# Altium schematic sheet Power_Supply.SchDoc: Apalis Evaluation Board 1.1
size A3; Organization: Toradex AG; Address1: Altsagenstrasse 5; Address2: Horw; Address3: 6048; Address4: Switzerland; DocumentNumber: 3; Revision: V1.1; SheetNumber: 3; SheetTotal: 32; PageSetup: Record=PageOptions|CenterHorizontal=True|CenterVertical=True|PrintScale=0.73|XCorrection=1.00|YCorrection=1.00|PrintKind=0|BorderSize=5000000|LeftOffset=0|BottomOffset=0|Orientation=2|PaperLength=1000|PaperWidth=1000|Scale=100|PaperSource=7|PrintQuality=-4|MediaType=1|DitherType=10|PaperKind=A4|PrintScaleMode=1
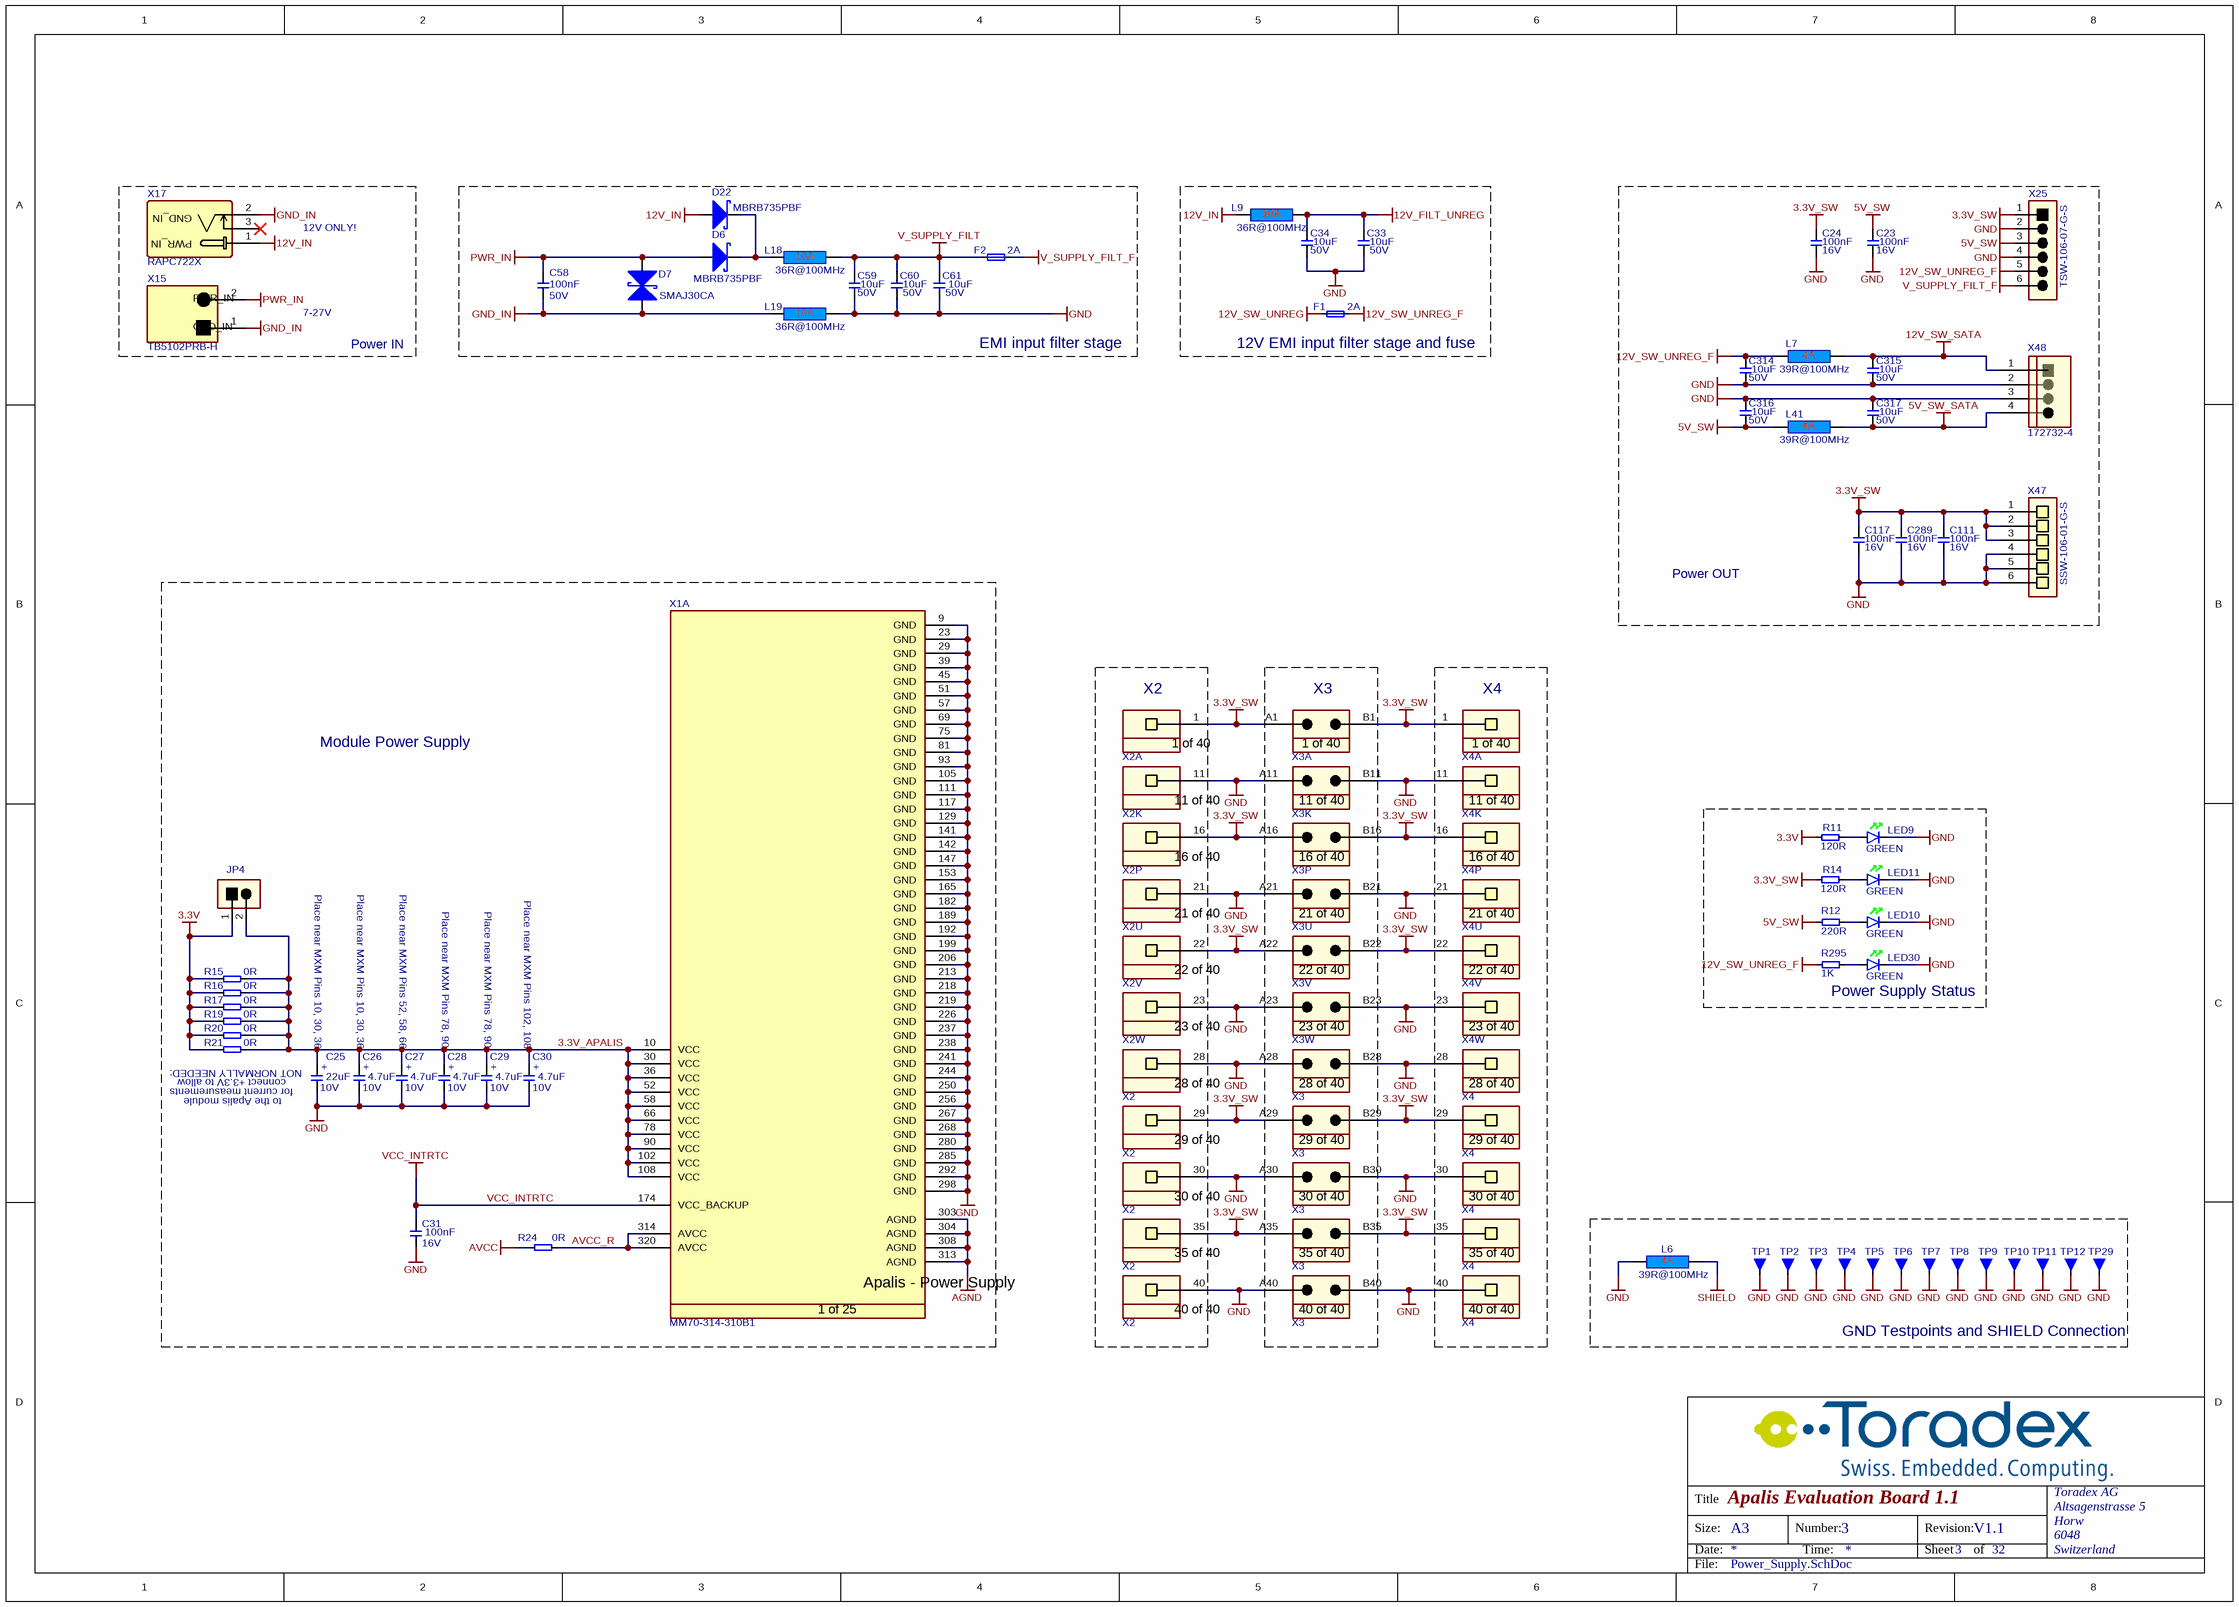
[diagram p0: Power_Supply.SchDoc]

## Parts
C23  Rating: 16V  [T_CAPC0603X33N]  (hidden comment: 100nF)
C24  Rating: 16V  [T_CAPC0603X33N]  (hidden comment: 100nF)
C25  Rating: 10V  [CAPMP3528X210N]  (hidden comment: 22uF)
C26  Rating: 10V  [T_CAPMP3216X180N]  (hidden comment: 4.7uF)
C27  Rating: 10V  [T_CAPMP3216X180N]  (hidden comment: 4.7uF)
C28  Rating: 10V  [T_CAPMP3216X180N]  (hidden comment: 4.7uF)
C29  Rating: 10V  [T_CAPMP3216X180N]  (hidden comment: 4.7uF)
C30  Rating: 10V  [T_CAPMP3216X180N]  (hidden comment: 4.7uF)
C31  Rating: 16V  [T_CAPC0603X33N]  (hidden comment: 100nF)
C33  Rating: 50V  [CAPC3225X160N]  (hidden comment: 10uF)
C34  Rating: 50V  [CAPC3225X160N]  (hidden comment: 10uF)
C58  Rating: 50V  [T_CAPC0603X33N]  (hidden comment: 100nF)
C59  Rating: 50V  [CAPC3225X160N]  (hidden comment: 10uF)
C60  Rating: 50V  [CAPC3225X160N]  (hidden comment: 10uF)
C61  Rating: 50V  [CAPC3225X160N]  (hidden comment: 10uF)
C111  Rating: 16V  [T_CAPC0603X33N]  (hidden comment: 100nF)
C117  Rating: 16V  [T_CAPC0603X33N]  (hidden comment: 100nF)
C289  Rating: 16V  [T_CAPC0603X33N]  (hidden comment: 100nF)
C314  Rating: 50V  [CAPC3225X160N]  (hidden comment: 10uF)
C315  Rating: 50V  [CAPC3225X160N]  (hidden comment: 10uF)
C316  Rating: 50V  [CAPC3225X160N]  (hidden comment: 10uF)
C317  Rating: 50V  [CAPC3225X160N]  (hidden comment: 10uF)
D6  MBRB735PBF  [T_VISHAY_MBRB735PBF]
D7  Manufacturer Part No.: SMAJ30CA  [T_LITTLEFUSE_SMAJ30CA]  (hidden comment: D-Littelfuse-SMAJ30CA-Schottky)
D22  MBRB735PBF  [T_VISHAY_MBRB735PBF]
F1  2A  [T_Littelfuse_0458]
F2  2A  [T_Littelfuse_0458]
JP4  TSW-101-07-G-D  [T_Samtec_TSW-101-07-G-D]  (value not drawn)
L6  39R@100MHz  [INDC2013X130N]
L7  39R@100MHz  [INDC2013X130N]
L9  36R@100MHz  [T_Laird_35F0121-0SR-10]
L18  36R@100MHz  [T_Laird_35F0121-0SR-10]
L19  36R@100MHz  [T_Laird_35F0121-0SR-10]
L41  39R@100MHz  [INDC2013X130N]
LED9  Color: GREEN  [T_Osram_T670_GREEN]  (hidden comment: LG T670-K1L2-1)
LED10  Color: GREEN  [T_Osram_T670_GREEN]  (hidden comment: LG T670-K1L2-1)
LED11  Color: GREEN  [T_Osram_T670_GREEN]  (hidden comment: LG T670-K1L2-1)
LED30  Color: GREEN  [T_Osram_T670_GREEN]  (hidden comment: LG T670-K1L2-1)
R11  120R  [T_RESC0603X30N]
R12  220R  [T_RESC0603X30N]
R14  120R  [T_RESC0603X30N]
R15  0R  [T_RESC3216X760N]
R16  0R  [T_RESC3216X760N]
R17  0R  [T_RESC3216X760N]
R19  0R  [T_RESC3216X760N]
R20  0R  [T_RESC3216X760N]
R21  0R  [T_RESC3216X760N]
R24  0R  [T_RESC0603X30N]
R295  1K  [T_RESC0603X30N]
TP1  5011  [T_TP-THT - EYE]  (value not drawn)
TP2  5011  [T_TP-THT - EYE]  (value not drawn)
TP3  5011  [T_TP-THT - EYE]  (value not drawn)
TP4  5011  [T_TP-THT - EYE]  (value not drawn)
TP5  5011  [T_TP-THT - EYE]  (value not drawn)
TP6  5011  [T_TP-THT - EYE]  (value not drawn)
TP7  5011  [T_TP-THT - EYE]  (value not drawn)
TP8  5011  [T_TP-THT - EYE]  (value not drawn)
TP9  5011  [T_TP-THT - EYE]  (value not drawn)
TP10  5011  [T_TP-THT - EYE]  (value not drawn)
TP11  5011  [T_TP-THT - EYE]  (value not drawn)
TP12  5011  [T_TP-THT - EYE]  (value not drawn)
TP29  5011  [T_TP-THT - EYE]  (value not drawn)
X1  Manufacturer Part No.: MM70-314-310B1  [T_JAE_MM70-314-310B1]  (hidden comment: CON-JAE-MM70-314-310B1-314-0.5mm)  (part A of 25)
X2  SSW-110-01-G-S  [T_Samtec_SSW-110-01-G-S]  (value not drawn)  (parts A,K,P,U,V,W,28,29,30,35,40 of 40)
X3  TSW-110-07-G-D  [T_Samtec_TSW-110-07-G-D]  (value not drawn)  (parts A,K,P,U,V,W,28,29,30,35,40 of 40)
X4  SSW-110-01-G-S  [T_Samtec_SSW-110-01-G-S]  (value not drawn)  (parts A,K,P,U,V,W,28,29,30,35,40 of 40)
X15  TB5102PRB-H  [T_AUK_TB5102PRB-H]
X17  RAPC722X  [T_DCJ20-0014TB-L]
X25  TSW-106-07-G-S  [T_samtech_TSW-106-07-G-S]
X47  SSW-106-01-G-S  [T_samtech_SSW-106-01-G-S]
X48  172732-4  [T_TE_172732-4]

## Blocks framed on the sheet
Power IN: X15 X17
EMI input filter stage: C58-C61 D6 D7 D22 F2 L18 L19
12V EMI input filter stage and fuse: C33 C34 F1 L9
Power OUT: C23 C24 C111 C117 C289 C314-C317 L7 L41 X25 X47 X48
Module Power Supply: C25-C31 JP4 R15-R17 R19-R21 R24 X1
X2: X2
X3: X3
X4: X4
Power Supply Status: LED9-LED11 LED30 R11 R12 R14 R295
GND Testpoints and SHIELD Connection: L6 TP1-TP12 TP29

## Nets
3.3V: JP4.1 R11.1 R15.1 R16.1 R17.1 R19.1 R20.1 R21.1
3.3V_SW: C24.2 C111.2 C117.2 C289.2 R14.1 X2.1 X2.16 X2.22 X2.29 X2.35 X3.A1 X3.A16 X3.A22 X3.A29 X3.A35 X3.B1 X3.B16 X3.B22 X3.B29 X3.B35 X4.1 X4.16 X4.22 X4.29 X4.35 X25.1 X47.1 X47.2 X47.3
5V_SW: C23.1 C316.1 L41.1 R12.1 X25.3
5V_SW_SATA: C317.1 L41.2 X48.4(5V)
12V_FILT_UNREG: C33.2 C34.2 L9.2
12V_IN: D22.3 L9.1 X17.1(GND_IN)
12V_SW_SATA: C315.2 L7.2 X48.1(12V)
12V_SW_UNREG: F1.1
12V_SW_UNREG_F: C314.2 F1.2 L7.1 R295.1 X25.5
AGND: X1.303(AGND) X1.304(AGND) X1.308(AGND) X1.313(AGND)
AVCC: R24.1
GND: C23.2 C24.1 C25.2 C26.2 C27.2 C28.2 C29.2 C30.2 C31.1 C33.1 C34.1 C59.1 C60.1 C61.1 C111.1 C117.1 C289.1 C314.1 C315.1 C316.2 C317.2 L6.1 L19.2 LED9.K LED10.K LED11.K LED30.K TP1.1 TP2.1 TP3.1 TP4.1 TP5.1 TP6.1 TP7.1 TP8.1 TP9.1 TP10.1 TP11.1 TP12.1 TP29.1 X1.9(GND) X1.23(GND) X1.29(GND) X1.39(GND) X1.45(GND) X1.51(GND) X1.57(GND) X1.69(GND) X1.75(GND) X1.81(GND) X1.93(GND) X1.105(GND) X1.111(GND) X1.117(GND) X1.129(GND) X1.141(GND) X1.142(GND) X1.147(GND) X1.153(GND) X1.165(GND) X1.182(GND) X1.189(GND) X1.192(GND) X1.199(GND) X1.206(GND) X1.213(GND) X1.218(GND) X1.219(GND) X1.226(GND) X1.237(GND) X1.238(GND) X1.241(GND) X1.244(GND) X1.250(GND) X1.256(GND) X1.267(GND) X1.268(GND) X1.280(GND) X1.285(GND) X1.292(GND) X1.298(GND) X2.11 X2.21 X2.23 X2.28 X2.30 X2.40 X3.A11 X3.A21 X3.A23 X3.A28 X3.A30 X3.A40 X3.B11 X3.B21 X3.B23 X3.B28 X3.B30 X3.B40 X4.11 X4.21 X4.23 X4.28 X4.30 X4.40 X25.2 X25.4 X47.4 X47.5 X47.6 X48.2(GND) X48.3(GND)
GND_IN: C58.1 D7.2(Anode) L19.1 X15.1(GND_IN) X17.2(PWR_IN)
PWR_IN: C58.2 D6.3 D7.1(Cathode) X15.2(PWR_IN)
SHIELD: L6.2
V_SUPPLY_FILT: C59.2 C60.2 C61.2 F2.1 L18.2
V_SUPPLY_FILT_F: F2.2 X25.6
VCC_INTRTC: C31.2 X1.174(VCC_BACKUP)
3.3V_APALIS: C25.1 C26.1 C27.1 C28.1 C29.1 C30.1 JP4.2 R15.2 R16.2 R17.2 R19.2 R20.2 R21.2 X1.10(VCC) X1.30(VCC) X1.36(VCC) X1.52(VCC) X1.58(VCC) X1.66(VCC) X1.78(VCC) X1.90(VCC) X1.102(VCC) X1.108(VCC)
AVCC_R: R24.2 X1.314(AVCC) X1.320(AVCC)
NetD6_2: D6.2 D22.2 L18.1
NetLED9_A: LED9.A R11.2
NetLED10_A: LED10.A R12.2
NetLED11_A: LED11.A R14.2
NetLED30_A: LED30.A R295.2

Not connected (* = marked no-connect by the designer): X17 3(PWR_IN)*

## Notes on the sheet
- 12V ONLY!
- 7-27V
- (near C25) Place near MXM Pins 10, 30, 36
- (near C26) Place near MXM Pins 10, 30, 36
- (near C27) Place near MXM Pins 52, 58, 66
- Place near MXM Pins 78, 90
- Place near MXM Pins 102, 108
- to the Apalis module
- connect +3.3V to allow
- for current measurements
- NOT NORMALLY NEEDED:
- Title
- Size:
- Date:
- A3
- Number:
- Time:
- Revision:
- Sheet
- of
- File:
- (in symbol C-TA-4.7uF-10V-20%-3216) +
- (in symbol C-TA-22uF-10V-20%-3528) +
- (in symbol CON-JAE-MM70-314-310B1-314-0.5mm, part A) Apalis - Power Supply; 1 of 25
- (in symbol CON-Samtec-SSW-110-01-G-S, part A) 1 of 40
- (in symbol CON-Samtec-SSW-110-01-G-S, part K) 11 of 40
- (in symbol CON-Samtec-SSW-110-01-G-S, part P) 16 of 40
- (in symbol CON-Samtec-SSW-110-01-G-S, part U) 21 of 40
- (in symbol CON-Samtec-SSW-110-01-G-S, part V) 22 of 40
- (in symbol CON-Samtec-SSW-110-01-G-S, part W) 23 of 40
- (in symbol CON-Samtec-SSW-110-01-G-S, part 28) 28 of 40
- (in symbol CON-Samtec-SSW-110-01-G-S, part 29) 29 of 40
- (in symbol CON-Samtec-SSW-110-01-G-S, part 30) 30 of 40
- (in symbol CON-Samtec-SSW-110-01-G-S, part 35) 35 of 40
- (in symbol CON-Samtec-SSW-110-01-G-S, part 40) 40 of 40
- (in symbol CON-Samtec-TSW-110-07-G-D, part A) 1 of 40
- (in symbol CON-Samtec-TSW-110-07-G-D, part K) 11 of 40
- (in symbol CON-Samtec-TSW-110-07-G-D, part P) 16 of 40
- (in symbol CON-Samtec-TSW-110-07-G-D, part U) 21 of 40
- (in symbol CON-Samtec-TSW-110-07-G-D, part V) 22 of 40
- (in symbol CON-Samtec-TSW-110-07-G-D, part W) 23 of 40
- (in symbol CON-Samtec-TSW-110-07-G-D, part 28) 28 of 40
- (in symbol CON-Samtec-TSW-110-07-G-D, part 29) 29 of 40
- (in symbol CON-Samtec-TSW-110-07-G-D, part 30) 30 of 40
- (in symbol CON-Samtec-TSW-110-07-G-D, part 35) 35 of 40
- (in symbol CON-Samtec-TSW-110-07-G-D, part 40) 40 of 40

## Library data of the parts
C23 C24 C31 C111 C117 C289 = C-X7R-100nF-16V-10%-0603: Capacitor Ceramic X7R 100nF 16V 10% 0603; Tolerance: 10%; Type: X7R; Value: 100nF
C25 = C-TA-22uF-10V-20%-3528: Capacitor TA 22uF 10V 20% 3528; Tolerance: 20%; Type: TA; Value: 22uF
C26-C30 = C-TA-4.7uF-10V-20%-3216: Capacitor TA 4.7uF 10V 20% 3216; Tolerance: 20%; Type: TA; Value: 4.7uF
C33 C34 C59-C61 C314-C317 = C-X5R-10uF-50V-20%-1210: Capacitor Ceramic X5R 10uF 50V 20% 1210; Tolerance: 20%; Type: X5R; Value: 10uF
C58 = C-X7R-100nF-50V-20%-0603: Capacitor Ceramic X7R 100nF 50V 20% 0603; Tolerance: 20%; Type: X7R; Value: 100nF
D6 D22 = D-VISHAY-MBRB735PBF: MBRB735PBF Schottky Diode; Manufacturer Name: Vishay; Manufacturer Part No.: MBRB735PBF
D7 = D-Littelfuse-SMAJ30CA-Schottky: Bidirectional ESD protection; Manufacturer Name: Littelfuse
F1 F2 = F-Littelfuse-0458002: Fuse 2A Fast; Manufacturer Name: Littelfuse; Manufacturer Part No.: 0458002; Value: 2A
JP4 = CON-Samtec-TSW-101-07-G-D: Header male, 1x2 Pins, 2.54 mm pitch; Manufacturer Name: Samtec; Pitch: 2.54 mm; No. of ways: 1x2; Manufacturer Part no.: TSW-101-07-G-D
L6 L7 L41 = L-Panasonic-EXC-ML20A390U-39R@100MHz-4A-25%-0805: 39R@100MHz 4A EMI FILTER; Tolerance: 25%; Rating: 4A; Manufacturer Name: Panasonic; Manufacturer Name: EXC-ML20A390U; Value: 39R@100MHz
L9 L18 L19 = L-Laird-35F0121-0SR-10-10A-25%: Power Supply FB 10A; Tolerance: 25%; Rating: 10A; Value: 36R@100MHz
LED9-LED11 LED30 = LED-Osram-T670-K1L2-1: LED green Osram LG T670-K1L2-1; Manufacturer Name: Osram; Manufacturer Part No.: LG T670-K1L2-1
R11 R14 = R-120R-63mW-5%-0603: Resistor 120 ohm 63mW 5% 0603; Rating: 63mW; Tolerance: 5%; Value: 120R
R12 = R-220R-63mW-5%-0603: Resistor 220 ohm 63mW 5% 0603; Rating: 63mW; Tolerance: 5%; Value: 220R
R15-R17 R19-R21 = R-0R-63mW-1%-1206: Resistor 0 ohm 63mW 1% 1206; Rating: 63mW; Tolerance: 1%; Value: 0R
R24 = R-0R-63mW-1%-0603: Resistor 0 ohm 63mW 1% 0603; Rating: 63mW; Tolerance: 1%; Value: 0R
R295 = R-1KR-63mW-5%-0603: Resistor 1 Kohm 63mW 5% 0603; Rating: 63mW; Tolerance: 5%; Value: 1K
TP1-TP12 TP29 = TP-Keystone-5011: Testpin Eye TH; Manufacturer Name: Keystone; Manufacturer Part No.: 5011
X1 = CON-JAE-MM70-314-310B1-314-0.5mm: MXM3 Connector; Manufacturer Name: JAE; No. of ways: 314
X2 X4 = CON-Samtec-SSW-110-01-G-S: Receptacle Female Socket 1x40 pin 2.54mm pitch; Manufacturer Name: Samtec; Pitch: 2.54mm; No. of ways: 1x40; Manufacturer Part No.: SSW-110-01-G-S
X3 = CON-Samtec-TSW-110-07-G-D: Header 2x40 pin 2.54mm pitch; Manufacturer Name: Samtec; Pitch: 2.54mm; No. of ways: 2x40; Manufacturer Part No.: TSW-110-07-G-D
X15 = CON-AUK-TB5102PRB-H-1x2-50.8mm: Power Connector; Manufacturer Name: AUK; No. of ways: 1x2; Pitch: 5.08mm; Manufacturer Part No.: TB5102PRB-H
X17 = CON-SWC-RAPC722X: Power Jack; Manufacturer Name: SWC; Manufacturer Part No.: RAPC722X
X25 = CON-Samtec-TSW-106-07-G-S: Header male, 1X6 Pins, 2.54 mm pitch; Manufacturer Name: Samtec; Pitch: 2.54 mm; No. of ways: 1X6; Manufacturer Part No.: TSW-106-07-G-S
X47 = CON-Samtec-SSW-106-01-G-S: Receptacle Female Socket, 1x6 Pins, 2.54mm pitch; Manufacturer Name: Samtec; No. of ways: 1x6; Pitch: 2.54mm; Manufacturer Part No.: SSW-106-01-G-S
X48 = CON-TECon-172732-4: Header 4 pos Vert Kink Pin; Manufacturer Name: TE Connectivity; No. of ways: 4; Manufacturer Part No.: 172732-4